# Altium project DataAcquisitonBoard.PrjPcb
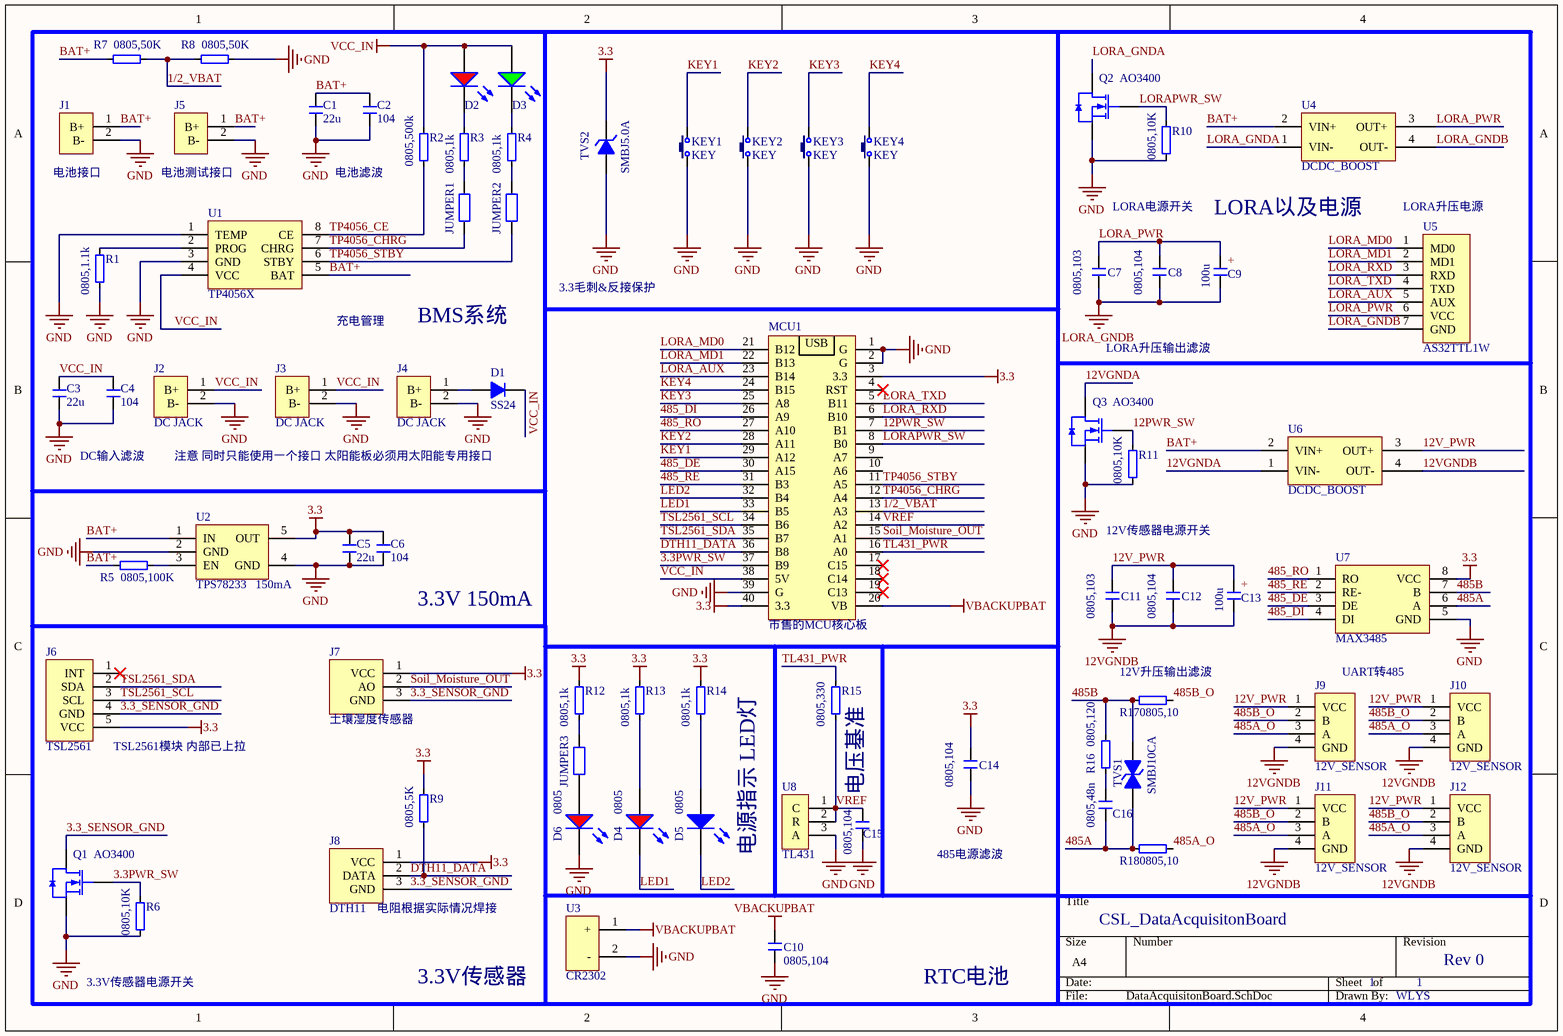
[diagram p0: DataAcquisitonBoard.SchDoc]
1 sheet, 73 parts. Net scope: global (net labels, ports and power ports of the same name join across sheets).
Board file: DataAcquisitonBoard.PcbDoc

## Sheet DataAcquisitonBoard.SchDoc
size A4

### Parts
C1  22u  [0805_C]
C2  104  [0805_C]
C3  22u  [0805_C]
C4  104  [0805_C]
C5  22u  [0805_C]
C6  104  [0805_C]
C7  0805,103  [0805_C]
C8  0805,104  [0805_C]
C9  100u  [CAP 2.5*6.3*11.2]
C10  0805,104  [0805_C]
C11  0805,103  [0805_C]
C12  0805,104  [0805_C]
C13  100u  [CAP 2.5*6.3*11.2]
C14  0805,104  [0805_C]
C15  0805,104  [0805_C]
C16  0805,48n  [0805_C]
D1  SS24  [SMB(DO-214AA)_S1]
D2  (no value)  [0805_LED_S1]
D3  (no value)  [0805_LED_S1]
D4  0805  [0805_LED_S1]
D5  0805  [0805_LED_S1]
D6  0805  [0805_LED_S1]
J1  电池接口  [XH2.54-LI-2P]
J2  DC JACK  [XH2.54-LI-2P]
J3  DC JACK  [XH2.54-LI-2P]
J4  DC JACK  [XH2.54-LI-2P]
J5  电池测试接口  [XH2.54-LI-2P]
J6  TSL2561  [XH2.54-LI-5P]
J7  土壤湿度传感器  [XH2.54-LI-3P]
J8  DTH11  [XH2.54-LI-3P]
J9  12V_SENSOR  [XH2.54-LI-4P]
J10  12V_SENSOR  [XH2.54-LI-4P]
J11  12V_SENSOR  [XH2.54-LI-4P]
J12  12V_SENSOR  [XH2.54-LI-4P]
JUMPER1  0805_JUMPER  [JUMPER]  (value not drawn)
JUMPER2  0805_JUMPER  [JUMPER]  (value not drawn)
JUMPER3  0805_JUMPER  [JUMPER]  (value not drawn)
KEY1  KEY  [TSW SMD-4*4*1.5]
KEY2  KEY  [TSW SMD-4*4*1.5]
KEY3  KEY  [TSW SMD-4*4*1.5]
KEY4  KEY  [TSW SMD-4*4*1.5]
MCU1  市售的MCU核心板  [STM32F103C8T6_CORE]
Q1  AO3400  [SOT-23(SOT-23-3)]
Q2  AO3400  [SOT-23(SOT-23-3)]
Q3  AO3400  [SOT-23(SOT-23-3)]
R1  0805,1.1k  [0805_R]
R2  0805,500k  [0805_R]
R3  0805,1k  [0805_R]
R4  0805,1k  [0805_R]
R5  0805,100K  [0805_R]
R6  0805,10K  [0805_R]
R7  0805,50K  [0805_R]
R8  0805,50K  [0805_R]
R9  0805,5K  [0805_R]
R10  0805,10K  [0805_R]
R11  0805,10K  [0805_R]
R12  0805,1k  [0805_R]
R13  0805,1k  [0805_R]
R14  0805,1k  [0805_R]
R15  0805,330  [0805_R]
R16  0805,120  [0805_R]
R17  0805,10  [0805_R]
R18  0805,10  [0805_R]
TVS1  SMBJ10CA  [SMB(DO-214AA)_S1]
TVS2  SMBJ5.0A  [SMB(DO-214AA)_S1]
U1  TP4056X  [SOIC-8_150mil]
U2  TPS78233  [SOT-23-5]
U3  CR2302  [CR2032_A]
U4  DCDC_BOOST  [BOOSTER]
U5  AS32TTL1W  [LORA]
U6  DCDC_BOOST  [BOOSTER]
U7  MAX3485  [SOIC-8_150mil]
U8  TL431  [SOT-23(SOT-23-3)]

### Nets
3.3: C5.1 C6.1 C14.1 J6.5(VCC) J7.1(VCC) J8.1(VCC) MCU1.3(3.3) MCU1.40(3.3) R9.1 R12.2 R13.2 R14.2 TVS2.2(K) U2.5(OUT) U7.8(VCC)
12VGNDB: C11.2 C12.2 C13.2 J9.4(GND) J10.4(GND) J11.4(GND) J12.4(GND) U6.4(OUT-)
GND: C1.2 C2.2 C3.2 C4.2 C5.2 C6.2 C10.2 C14.2 C15.2 D6.K J1.2(B-) J2.2(B-) J3.2(B-) J4.2(B-) J5.2(B-) KEY1.1 KEY2.1 KEY3.1 KEY4.1 MCU1.1(G) MCU1.2(G) MCU1.39(G) Q1.2(S) Q2.2(S) Q3.2(S) R1.1 R6.2 R8.1 R10.2 R11.2 TVS2.1(A) U1.1(TEMP) U1.3(GND) U2.2(GND) U2.4(GND) U3.2(-) U7.5(GND) U8.3(A)
LORA_GNDB: C7.2 C8.2 C9.2 U4.4(OUT-) U5.7(GND)
VBACKUPBAT: C10.1 MCU1.20(VB) U3.1(+)
VCC_IN: C3.1 C4.1 D1.2(K) D2.A D3.A J2.1(B+) J3.1(B+) MCU1.38(5V) R2.2 U1.4(VCC)
1/2_VBAT: MCU1.13(A3) R7.1 R8.2
3.3_SENSOR_GND: J6.4(GND) J7.3(GND) J8.3(GND) Q1.3(D)
3.3PWR_SW: MCU1.37(B9) Q1.1(G) R6.1
12PWR_SW: MCU1.7(B1) Q3.1(G) R11.1
12V_PWR: C11.1 C12.1 C13.1 J9.1(VCC) J10.1(VCC) J11.1(VCC) J12.1(VCC) U6.3(OUT+)
12VGNDA: Q3.3(D) U6.1(VIN-)
485_DE: MCU1.30(A15) U7.3(DE)
485_DI: MCU1.26(A9) U7.4(DI)
485_RE: MCU1.31(B3) U7.2(RE-)
485_RO: MCU1.27(A10) U7.1(RO)
485A: C16.2 R18.2 TVS1.1(A) U7.6(A)
485A_O: J9.3(A) J10.3(A) J11.3(A) J12.3(A) R18.1
485B: R16.1 R17.2 TVS1.2(K) U7.7(B)
485B_O: J9.2(B) J10.2(B) J11.2(B) J12.2(B) R17.1
BAT+: C1.1 C2.1 J1.1(B+) J5.1(B+) R5.2 R7.2 U1.5(BAT) U2.1(IN) U4.2(VIN+) U6.2(VIN+)
DTH11_DATA: J8.2(DATA) MCU1.36(B8) R9.2
KEY1: KEY1.2 MCU1.29(A12)
KEY2: KEY2.2 MCU1.28(A11)
KEY3: KEY3.2 MCU1.25(A8)
KEY4: KEY4.2 MCU1.24(B15)
LED1: D4.K MCU1.33(B5)
LED2: D5.K MCU1.32(B4)
LORA_AUX: MCU1.23(B14) U5.5(AUX)
LORA_GNDA: Q2.3(D) U4.1(VIN-)
LORA_MD0: MCU1.21(B12) U5.1(MD0)
LORA_MD1: MCU1.22(B13) U5.2(MD1)
LORA_PWR: C7.1 C8.1 C9.1 U4.3(OUT+) U5.6(VCC)
LORA_RXD: MCU1.6(B10) U5.3(RXD)
LORA_TXD: MCU1.5(B11) U5.4(TXD)
LORAPWR_SW: MCU1.8(B0) Q2.1(G) R10.1
Soil_Moisture_OUT: J7.2(AO) MCU1.15(A1)
TL431_PWR: MCU1.16(A0) R15.2
TP4056_CE: R2.1 U1.8(CE)
TP4056_CHRG: JUMPER1.1 MCU1.12(A4) U1.7(CHRG)
TP4056_STBY: JUMPER2.1 MCU1.11(A5) U1.6(STBY)
TSL2561_SCL: J6.3(SCL) MCU1.34(B6)
TSL2561_SDA: J6.2(SDA) MCU1.35(B7)
VREF: C15.1 MCU1.14(A2) R15.1 U8.1(C) U8.2(R)
NetC16_1: C16.1 R16.2
NetD1_1: D1.1(A) J4.1(B+)
NetD2_K: D2.K R3.2
NetD3_K: D3.K R4.2
NetD4_A: D4.A R13.1
NetD5_A: D5.A R14.1
NetD6_A: D6.A JUMPER3.1
NetJUMPER1_2: JUMPER1.2 R3.1
NetJUMPER2_2: JUMPER2.2 R4.1
NetJUMPER3_2: JUMPER3.2 R12.1
NetR1_2: R1.2 U1.2(PROG)
NetR5_1: R5.1 U2.3(EN)

Not connected (* = marked no-connect by the designer): J6 1(INT)*; MCU1 4(RST)* 9(A7) 10(A6) 17(C15)* 18(C14)* 19(C13)*

### Notes on the sheet
- 电池滤波
- LORA电源开关
- LORA以及电源
- LORA升压电源
- 3.3毛刺&反接保护
- 充电管理
- BMS系统
- LORA升压输出滤波
- DC输入滤波
- 注意 同时只能使用一个接口 太阳能板必须用太阳能专用接口
- 12V传感器电源开关
- (near U2) 150mA
- 3.3V 150mA
- (near R17) 12V升压输出滤波
- UART转485
- (near J6) TSL2561模块 内部已上拉
- 电压基准
- 电源指示 LED灯
- (near J8) 电阻根据实际情况焊接
- 485电源滤波
- CSL_DataAcquisitonBoard
- (near R6) 3.3V传感器电源开关
- 3.3V传感器
- RTC电池
- 1
- Rev 0
- WLYS
- (in symbol C直插电解) +
- (in symbol STM32F103C8T6_CORE) USB

### Library data of the parts
C1-C8 C10-C12 C14-C16 = C0805
C9 C13 = C直插电解
D1 = Diodo_214AA: Diodo diode
D2 D4 D6 = 0805 红灯: 发光二极管; ComponentLink1Description: 供应商链接; ComponentLink1URL: http://www.szlcsc.com/product/details_2668.html; Package: 0805; Supplier: LC; SuppliersPartNumber: C2295
D3 = 0805 翠绿: 发光二极管; ComponentLink1Description: 供应商链接; ComponentLink1URL: http://www.szlcsc.com/product/details_2670.html; Package: 0805; Supplier: LC; SuppliersPartNumber: C2297
D5 = 0805 蓝灯: 发光二极管; ComponentLink1Description: 供应商链接; ComponentLink1URL: http://www.szlcsc.com/product/details_2666.html; Package: 0805; Supplier: LC; SuppliersPartNumber: C2293
J1 = BAT
J2-J4 = DCINPUT: DC充电输入接口
J5 = BAT: 电池接口
J6 = TSL2561: IIC总线光强传感器模块 已经集成IIC上拉电阻
J7 = 土壤湿度
J8 = DTH11: 数字式温湿度传感器
J9-J12 = 12V_SENSOR: 12V传感器接口 包括 12V GND 485
JUMPER1-JUMPER3 = 0805_JUMPER: 0805大小的跳线; ComponentLink1Description: 供应商链接; ComponentLink1URL: http://www.szlcsc.com/product/details_18165.html; Package: 0805; Supplier: LC; SuppliersPartNumber: C17477
KEY1-KEY4 = TSW_4x4-SMT: Tact Switch
MCU1 = STM32F103C8T6_CORE
Q1-Q3 = AO3400A N道沟 X0YV1T SOT-23: MOS(场效应管); ComponentLink1Description: 供应商链接; ComponentLink1URL: http://www.szlcsc.com/product/details_21629.html; Package: SOT-23; Supplier: LC; SuppliersPartNumber: C20917
R1-R18 = R0805
TVS1 = TVS_214AA_BI: 双向TVS 214AA封装
TVS2 = TVS_214AA: TVS diode
U1 = TP4056X: 防反接锂电池充电管理IC
U2 = TPS782: Regulator_SMT; BOM名称: 可调升压芯片; 版权归属: 源创客; 学习资源: www.ooocke.com
U3 = CR2302: CR2302 3V电池
U5 = LORA_AS32TTL1W: 1W LORA无线串口
U7 = MAX3485: 3.3V供电带关断485半双工收发器
U8 = TL431AIDBZR: 德州仪器TL431 非国产TL431